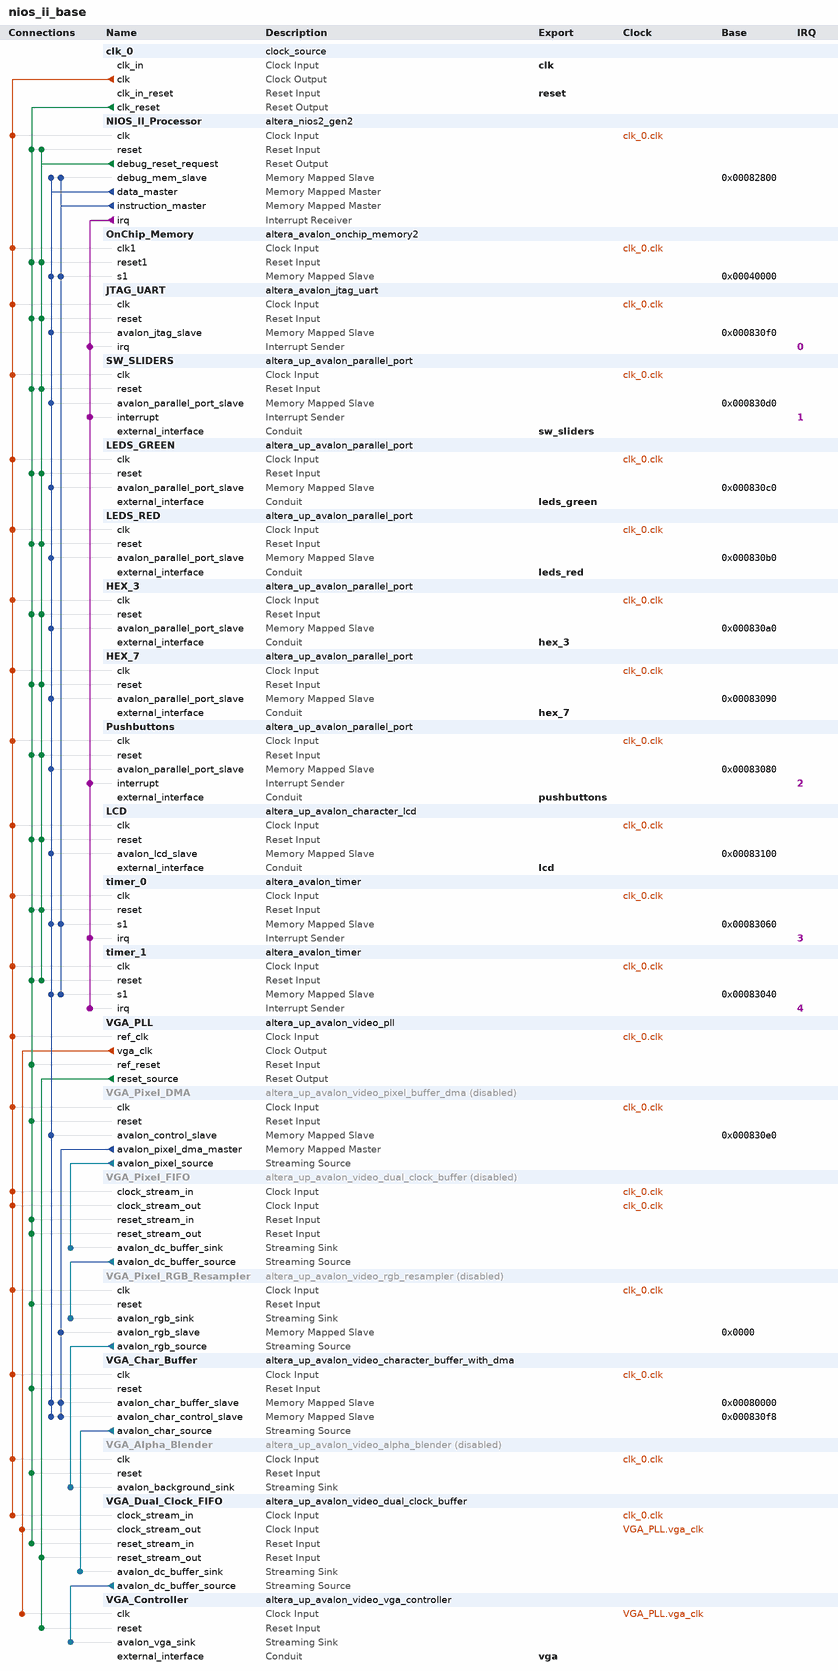
[diagram p0: system contents]
# Platform Designer (Qsys) system nios_ii_base, Cyclone IV GX EP4CGX150DF31C7
# Parameters at their usual value, and those the tool derives, are not listed.
package require -exact qsys 18.0
create_system nios_ii_base
set_project_property DEVICE_FAMILY {Cyclone IV GX}
set_project_property DEVICE EP4CGX150DF31C7

add_instance clk_0 clock_source 18.1
set_instance_parameter_value clk_0 clockFrequency 50000000

add_instance NIOS_II_Processor altera_nios2_gen2 18.1
set_instance_parameter_value NIOS_II_Processor dcache_size 2048
set_instance_parameter_value NIOS_II_Processor exceptionSlave OnChip_Memory.s1
set_instance_parameter_value NIOS_II_Processor icache_size 4096
set_instance_parameter_value NIOS_II_Processor impl Tiny
set_instance_parameter_value NIOS_II_Processor resetSlave OnChip_Memory.s1

add_instance OnChip_Memory altera_avalon_onchip_memory2 18.1
set_instance_parameter_value OnChip_Memory dataWidth 64
set_instance_parameter_value OnChip_Memory dualPort false
set_instance_parameter_value OnChip_Memory initMemContent true
set_instance_parameter_value OnChip_Memory initializationFileName onchip_mem.hex
set_instance_parameter_value OnChip_Memory memorySize 256000

add_instance JTAG_UART altera_avalon_jtag_uart 18.1
set_instance_parameter_value JTAG_UART simInteractiveOptions NO_INTERACTIVE_WINDOWS

add_instance SW_SLIDERS altera_up_avalon_parallel_port 18.0
set_instance_parameter_value SW_SLIDERS board DE2i-150
set_instance_parameter_value SW_SLIDERS capture true
set_instance_parameter_value SW_SLIDERS edge Rising
set_instance_parameter_value SW_SLIDERS irq true
set_instance_parameter_value SW_SLIDERS preset {Slider Switches}

add_instance LEDS_GREEN altera_up_avalon_parallel_port 18.0
set_instance_parameter_value LEDS_GREEN board DE2i-150
set_instance_parameter_value LEDS_GREEN capture false
set_instance_parameter_value LEDS_GREEN edge Rising
set_instance_parameter_value LEDS_GREEN irq false
set_instance_parameter_value LEDS_GREEN preset LEDs

add_instance LEDS_RED altera_up_avalon_parallel_port 18.0
set_instance_parameter_value LEDS_RED board DE2i-150
set_instance_parameter_value LEDS_RED capture false
set_instance_parameter_value LEDS_RED edge Rising
set_instance_parameter_value LEDS_RED irq false
set_instance_parameter_value LEDS_RED leds Red
set_instance_parameter_value LEDS_RED preset LEDs

add_instance HEX_3 altera_up_avalon_parallel_port 18.0
set_instance_parameter_value HEX_3 board DE2i-150
set_instance_parameter_value HEX_3 capture false
set_instance_parameter_value HEX_3 edge Rising
set_instance_parameter_value HEX_3 irq false
set_instance_parameter_value HEX_3 preset {Seven Segment Displays}

add_instance HEX_7 altera_up_avalon_parallel_port 18.0
set_instance_parameter_value HEX_7 board DE2i-150
set_instance_parameter_value HEX_7 capture false
set_instance_parameter_value HEX_7 edge Rising
set_instance_parameter_value HEX_7 irq false
set_instance_parameter_value HEX_7 preset {Seven Segment Displays}
set_instance_parameter_value HEX_7 sevensegs {7 to 4}

add_instance Pushbuttons altera_up_avalon_parallel_port 18.0
set_instance_parameter_value Pushbuttons board DE2i-150
set_instance_parameter_value Pushbuttons capture true
set_instance_parameter_value Pushbuttons edge Rising
set_instance_parameter_value Pushbuttons irq true
set_instance_parameter_value Pushbuttons preset Pushbuttons

add_instance LCD altera_up_avalon_character_lcd 18.0
set_instance_parameter_value LCD cursor Normal

add_instance timer_0 altera_avalon_timer 18.1
set_instance_parameter_value timer_0 period 1
set_instance_parameter_value timer_0 periodUnits MSEC

add_instance timer_1 altera_avalon_timer 18.1
set_instance_parameter_value timer_1 period 1
set_instance_parameter_value timer_1 periodUnits MSEC

add_instance VGA_PLL altera_up_avalon_video_pll 18.0
set_instance_parameter_value VGA_PLL camera {5MP Digital Camera (THDB_D5M)}
set_instance_parameter_value VGA_PLL gui_refclk 50.0
set_instance_parameter_value VGA_PLL lcd {7" LCD on VEEK-MT and MTL/MTL2 Modules}

add_instance VGA_Pixel_DMA altera_up_avalon_video_pixel_buffer_dma 18.0
set_instance_property VGA_Pixel_DMA ENABLED false
set_instance_parameter_value VGA_Pixel_DMA addr_mode X-Y
set_instance_parameter_value VGA_Pixel_DMA back_start_address 0
set_instance_parameter_value VGA_Pixel_DMA color_space {24-bit RGB}
set_instance_parameter_value VGA_Pixel_DMA image_height 480
set_instance_parameter_value VGA_Pixel_DMA image_width 640
set_instance_parameter_value VGA_Pixel_DMA start_address 0

add_instance VGA_Pixel_FIFO altera_up_avalon_video_dual_clock_buffer 18.0
set_instance_property VGA_Pixel_FIFO ENABLED false
set_instance_parameter_value VGA_Pixel_FIFO color_bits 8

add_instance VGA_Pixel_RGB_Resampler altera_up_avalon_video_rgb_resampler 18.0
set_instance_property VGA_Pixel_RGB_Resampler ENABLED false
set_instance_parameter_value VGA_Pixel_RGB_Resampler alpha 1023
set_instance_parameter_value VGA_Pixel_RGB_Resampler input_type {24-bit RGB}
set_instance_parameter_value VGA_Pixel_RGB_Resampler output_type {30-bit RGB}

add_instance VGA_Char_Buffer altera_up_avalon_video_character_buffer_with_dma 18.0
set_instance_parameter_value VGA_Char_Buffer enable_transparency false

add_instance VGA_Alpha_Blender altera_up_avalon_video_alpha_blender 18.0
set_instance_property VGA_Alpha_Blender ENABLED false

add_instance VGA_Dual_Clock_FIFO altera_up_avalon_video_dual_clock_buffer 18.0
set_instance_parameter_value VGA_Dual_Clock_FIFO color_bits 10

add_instance VGA_Controller altera_up_avalon_video_vga_controller 18.0
set_instance_parameter_value VGA_Controller board DE2i-150
set_instance_parameter_value VGA_Controller resolution {VGA 640x480}

# connections
add_connection clk_0.clk HEX_3.clk clock
add_connection clk_0.clk HEX_7.clk clock
add_connection clk_0.clk JTAG_UART.clk clock
add_connection clk_0.clk LCD.clk clock
add_connection clk_0.clk LEDS_GREEN.clk clock
add_connection clk_0.clk LEDS_RED.clk clock
add_connection clk_0.clk NIOS_II_Processor.clk clock
add_connection clk_0.clk OnChip_Memory.clk1 clock
add_connection clk_0.clk Pushbuttons.clk clock
add_connection clk_0.clk SW_SLIDERS.clk clock
add_connection clk_0.clk timer_0.clk clock
add_connection clk_0.clk timer_1.clk clock
add_connection clk_0.clk VGA_Alpha_Blender.clk clock
add_connection clk_0.clk VGA_Char_Buffer.clk clock
add_connection clk_0.clk VGA_Dual_Clock_FIFO.clock_stream_in clock
add_connection clk_0.clk VGA_Pixel_DMA.clk clock
add_connection clk_0.clk VGA_Pixel_FIFO.clock_stream_in clock
add_connection clk_0.clk VGA_Pixel_FIFO.clock_stream_out clock
add_connection clk_0.clk VGA_Pixel_RGB_Resampler.clk clock
add_connection clk_0.clk VGA_PLL.ref_clk clock
add_connection VGA_PLL.vga_clk VGA_Controller.clk clock
add_connection VGA_PLL.vga_clk VGA_Dual_Clock_FIFO.clock_stream_out clock
add_connection clk_0.clk_reset HEX_3.reset reset
add_connection clk_0.clk_reset HEX_7.reset reset
add_connection clk_0.clk_reset JTAG_UART.reset reset
add_connection clk_0.clk_reset LCD.reset reset
add_connection clk_0.clk_reset LEDS_GREEN.reset reset
add_connection clk_0.clk_reset LEDS_RED.reset reset
add_connection clk_0.clk_reset NIOS_II_Processor.reset reset
add_connection clk_0.clk_reset OnChip_Memory.reset1 reset
add_connection clk_0.clk_reset Pushbuttons.reset reset
add_connection clk_0.clk_reset SW_SLIDERS.reset reset
add_connection clk_0.clk_reset timer_0.reset reset
add_connection clk_0.clk_reset timer_1.reset reset
add_connection clk_0.clk_reset VGA_Alpha_Blender.reset reset
add_connection clk_0.clk_reset VGA_Char_Buffer.reset reset
add_connection clk_0.clk_reset VGA_Dual_Clock_FIFO.reset_stream_in reset
add_connection clk_0.clk_reset VGA_Pixel_DMA.reset reset
add_connection clk_0.clk_reset VGA_Pixel_FIFO.reset_stream_in reset
add_connection clk_0.clk_reset VGA_Pixel_FIFO.reset_stream_out reset
add_connection clk_0.clk_reset VGA_Pixel_RGB_Resampler.reset reset
add_connection clk_0.clk_reset VGA_PLL.ref_reset reset
add_connection NIOS_II_Processor.debug_reset_request HEX_3.reset reset
add_connection NIOS_II_Processor.debug_reset_request HEX_7.reset reset
add_connection NIOS_II_Processor.debug_reset_request JTAG_UART.reset reset
add_connection NIOS_II_Processor.debug_reset_request LCD.reset reset
add_connection NIOS_II_Processor.debug_reset_request LEDS_GREEN.reset reset
add_connection NIOS_II_Processor.debug_reset_request LEDS_RED.reset reset
add_connection NIOS_II_Processor.debug_reset_request NIOS_II_Processor.reset reset
add_connection NIOS_II_Processor.debug_reset_request OnChip_Memory.reset1 reset
add_connection NIOS_II_Processor.debug_reset_request Pushbuttons.reset reset
add_connection NIOS_II_Processor.debug_reset_request SW_SLIDERS.reset reset
add_connection NIOS_II_Processor.debug_reset_request timer_0.reset reset
add_connection NIOS_II_Processor.debug_reset_request timer_1.reset reset
add_connection VGA_PLL.reset_source VGA_Controller.reset reset
add_connection VGA_PLL.reset_source VGA_Dual_Clock_FIFO.reset_stream_out reset
add_connection NIOS_II_Processor.data_master HEX_3.avalon_parallel_port_slave avalon
set_connection_parameter_value NIOS_II_Processor.data_master/HEX_3.avalon_parallel_port_slave baseAddress 0x000830a0
add_connection NIOS_II_Processor.data_master HEX_7.avalon_parallel_port_slave avalon
set_connection_parameter_value NIOS_II_Processor.data_master/HEX_7.avalon_parallel_port_slave baseAddress 0x00083090
add_connection NIOS_II_Processor.data_master JTAG_UART.avalon_jtag_slave avalon
set_connection_parameter_value NIOS_II_Processor.data_master/JTAG_UART.avalon_jtag_slave baseAddress 0x000830f0
add_connection NIOS_II_Processor.data_master LCD.avalon_lcd_slave avalon
set_connection_parameter_value NIOS_II_Processor.data_master/LCD.avalon_lcd_slave baseAddress 0x00083100
add_connection NIOS_II_Processor.data_master LEDS_GREEN.avalon_parallel_port_slave avalon
set_connection_parameter_value NIOS_II_Processor.data_master/LEDS_GREEN.avalon_parallel_port_slave baseAddress 0x000830c0
add_connection NIOS_II_Processor.data_master LEDS_RED.avalon_parallel_port_slave avalon
set_connection_parameter_value NIOS_II_Processor.data_master/LEDS_RED.avalon_parallel_port_slave baseAddress 0x000830b0
add_connection NIOS_II_Processor.data_master NIOS_II_Processor.debug_mem_slave avalon
set_connection_parameter_value NIOS_II_Processor.data_master/NIOS_II_Processor.debug_mem_slave baseAddress 0x00082800
add_connection NIOS_II_Processor.data_master OnChip_Memory.s1 avalon
set_connection_parameter_value NIOS_II_Processor.data_master/OnChip_Memory.s1 baseAddress 0x00040000
add_connection NIOS_II_Processor.data_master Pushbuttons.avalon_parallel_port_slave avalon
set_connection_parameter_value NIOS_II_Processor.data_master/Pushbuttons.avalon_parallel_port_slave baseAddress 0x00083080
add_connection NIOS_II_Processor.data_master SW_SLIDERS.avalon_parallel_port_slave avalon
set_connection_parameter_value NIOS_II_Processor.data_master/SW_SLIDERS.avalon_parallel_port_slave baseAddress 0x000830d0
add_connection NIOS_II_Processor.data_master timer_0.s1 avalon
set_connection_parameter_value NIOS_II_Processor.data_master/timer_0.s1 baseAddress 0x00083060
add_connection NIOS_II_Processor.data_master timer_1.s1 avalon
set_connection_parameter_value NIOS_II_Processor.data_master/timer_1.s1 baseAddress 0x00083040
add_connection NIOS_II_Processor.data_master VGA_Char_Buffer.avalon_char_buffer_slave avalon
set_connection_parameter_value NIOS_II_Processor.data_master/VGA_Char_Buffer.avalon_char_buffer_slave baseAddress 0x00080000
add_connection NIOS_II_Processor.data_master VGA_Char_Buffer.avalon_char_control_slave avalon
set_connection_parameter_value NIOS_II_Processor.data_master/VGA_Char_Buffer.avalon_char_control_slave baseAddress 0x000830f8
add_connection NIOS_II_Processor.data_master VGA_Pixel_DMA.avalon_control_slave avalon
set_connection_parameter_value NIOS_II_Processor.data_master/VGA_Pixel_DMA.avalon_control_slave baseAddress 0x000830e0
add_connection NIOS_II_Processor.instruction_master NIOS_II_Processor.debug_mem_slave avalon
set_connection_parameter_value NIOS_II_Processor.instruction_master/NIOS_II_Processor.debug_mem_slave baseAddress 0x00082800
add_connection NIOS_II_Processor.instruction_master OnChip_Memory.s1 avalon
set_connection_parameter_value NIOS_II_Processor.instruction_master/OnChip_Memory.s1 baseAddress 0x00040000
add_connection NIOS_II_Processor.instruction_master timer_0.s1 avalon
set_connection_parameter_value NIOS_II_Processor.instruction_master/timer_0.s1 baseAddress 0x00083060
add_connection NIOS_II_Processor.instruction_master timer_1.s1 avalon
set_connection_parameter_value NIOS_II_Processor.instruction_master/timer_1.s1 baseAddress 0x00083040
add_connection VGA_Pixel_DMA.avalon_pixel_dma_master VGA_Char_Buffer.avalon_char_buffer_slave avalon
set_connection_parameter_value VGA_Pixel_DMA.avalon_pixel_dma_master/VGA_Char_Buffer.avalon_char_buffer_slave baseAddress 0x00080000
add_connection VGA_Pixel_DMA.avalon_pixel_dma_master VGA_Char_Buffer.avalon_char_control_slave avalon
set_connection_parameter_value VGA_Pixel_DMA.avalon_pixel_dma_master/VGA_Char_Buffer.avalon_char_control_slave baseAddress 0x000830f8
add_connection VGA_Pixel_DMA.avalon_pixel_dma_master VGA_Pixel_RGB_Resampler.avalon_rgb_slave avalon
set_connection_parameter_value VGA_Pixel_DMA.avalon_pixel_dma_master/VGA_Pixel_RGB_Resampler.avalon_rgb_slave baseAddress 0x0000
add_connection VGA_Char_Buffer.avalon_char_source VGA_Dual_Clock_FIFO.avalon_dc_buffer_sink avalon_streaming
add_connection VGA_Dual_Clock_FIFO.avalon_dc_buffer_source VGA_Controller.avalon_vga_sink avalon_streaming
add_connection VGA_Pixel_DMA.avalon_pixel_source VGA_Pixel_FIFO.avalon_dc_buffer_sink avalon_streaming
add_connection VGA_Pixel_FIFO.avalon_dc_buffer_source VGA_Pixel_RGB_Resampler.avalon_rgb_sink avalon_streaming
add_connection VGA_Pixel_RGB_Resampler.avalon_rgb_source VGA_Alpha_Blender.avalon_background_sink avalon_streaming
add_connection NIOS_II_Processor.irq JTAG_UART.irq interrupt
set_connection_parameter_value NIOS_II_Processor.irq/JTAG_UART.irq irqNumber 0
add_connection NIOS_II_Processor.irq Pushbuttons.interrupt interrupt
set_connection_parameter_value NIOS_II_Processor.irq/Pushbuttons.interrupt irqNumber 2
add_connection NIOS_II_Processor.irq SW_SLIDERS.interrupt interrupt
set_connection_parameter_value NIOS_II_Processor.irq/SW_SLIDERS.interrupt irqNumber 1
add_connection NIOS_II_Processor.irq timer_0.irq interrupt
set_connection_parameter_value NIOS_II_Processor.irq/timer_0.irq irqNumber 3
add_connection NIOS_II_Processor.irq timer_1.irq interrupt
set_connection_parameter_value NIOS_II_Processor.irq/timer_1.irq irqNumber 4

# exported interfaces
add_interface clk clock sink
set_interface_property clk EXPORT_OF clk_0.clk_in
add_interface hex_3 conduit end
set_interface_property hex_3 EXPORT_OF HEX_3.external_interface
add_interface hex_7 conduit end
set_interface_property hex_7 EXPORT_OF HEX_7.external_interface
add_interface lcd conduit end
set_interface_property lcd EXPORT_OF LCD.external_interface
add_interface leds_green conduit end
set_interface_property leds_green EXPORT_OF LEDS_GREEN.external_interface
add_interface leds_red conduit end
set_interface_property leds_red EXPORT_OF LEDS_RED.external_interface
add_interface pushbuttons conduit end
set_interface_property pushbuttons EXPORT_OF Pushbuttons.external_interface
add_interface reset reset sink
set_interface_property reset EXPORT_OF clk_0.clk_in_reset
add_interface sw_sliders conduit end
set_interface_property sw_sliders EXPORT_OF SW_SLIDERS.external_interface
add_interface vga conduit end
set_interface_property vga EXPORT_OF VGA_Controller.external_interface

set_interconnect_requirement {$system} qsys_mm.clockCrossingAdapter HANDSHAKE
set_interconnect_requirement {$system} qsys_mm.enableEccProtection FALSE
set_interconnect_requirement {$system} qsys_mm.insertDefaultSlave FALSE
set_interconnect_requirement {$system} qsys_mm.maxAdditionalLatency 1

save_system nios_ii_base.qsys
